# Altium schematic sheet A01_POWER_MCU.SchDoc: A01_POWER_MCU
size 420 x 296 mm; Revision: A-SCH-AD-R2-NO-TP; SheetNumber: 1; SheetTotal: 7
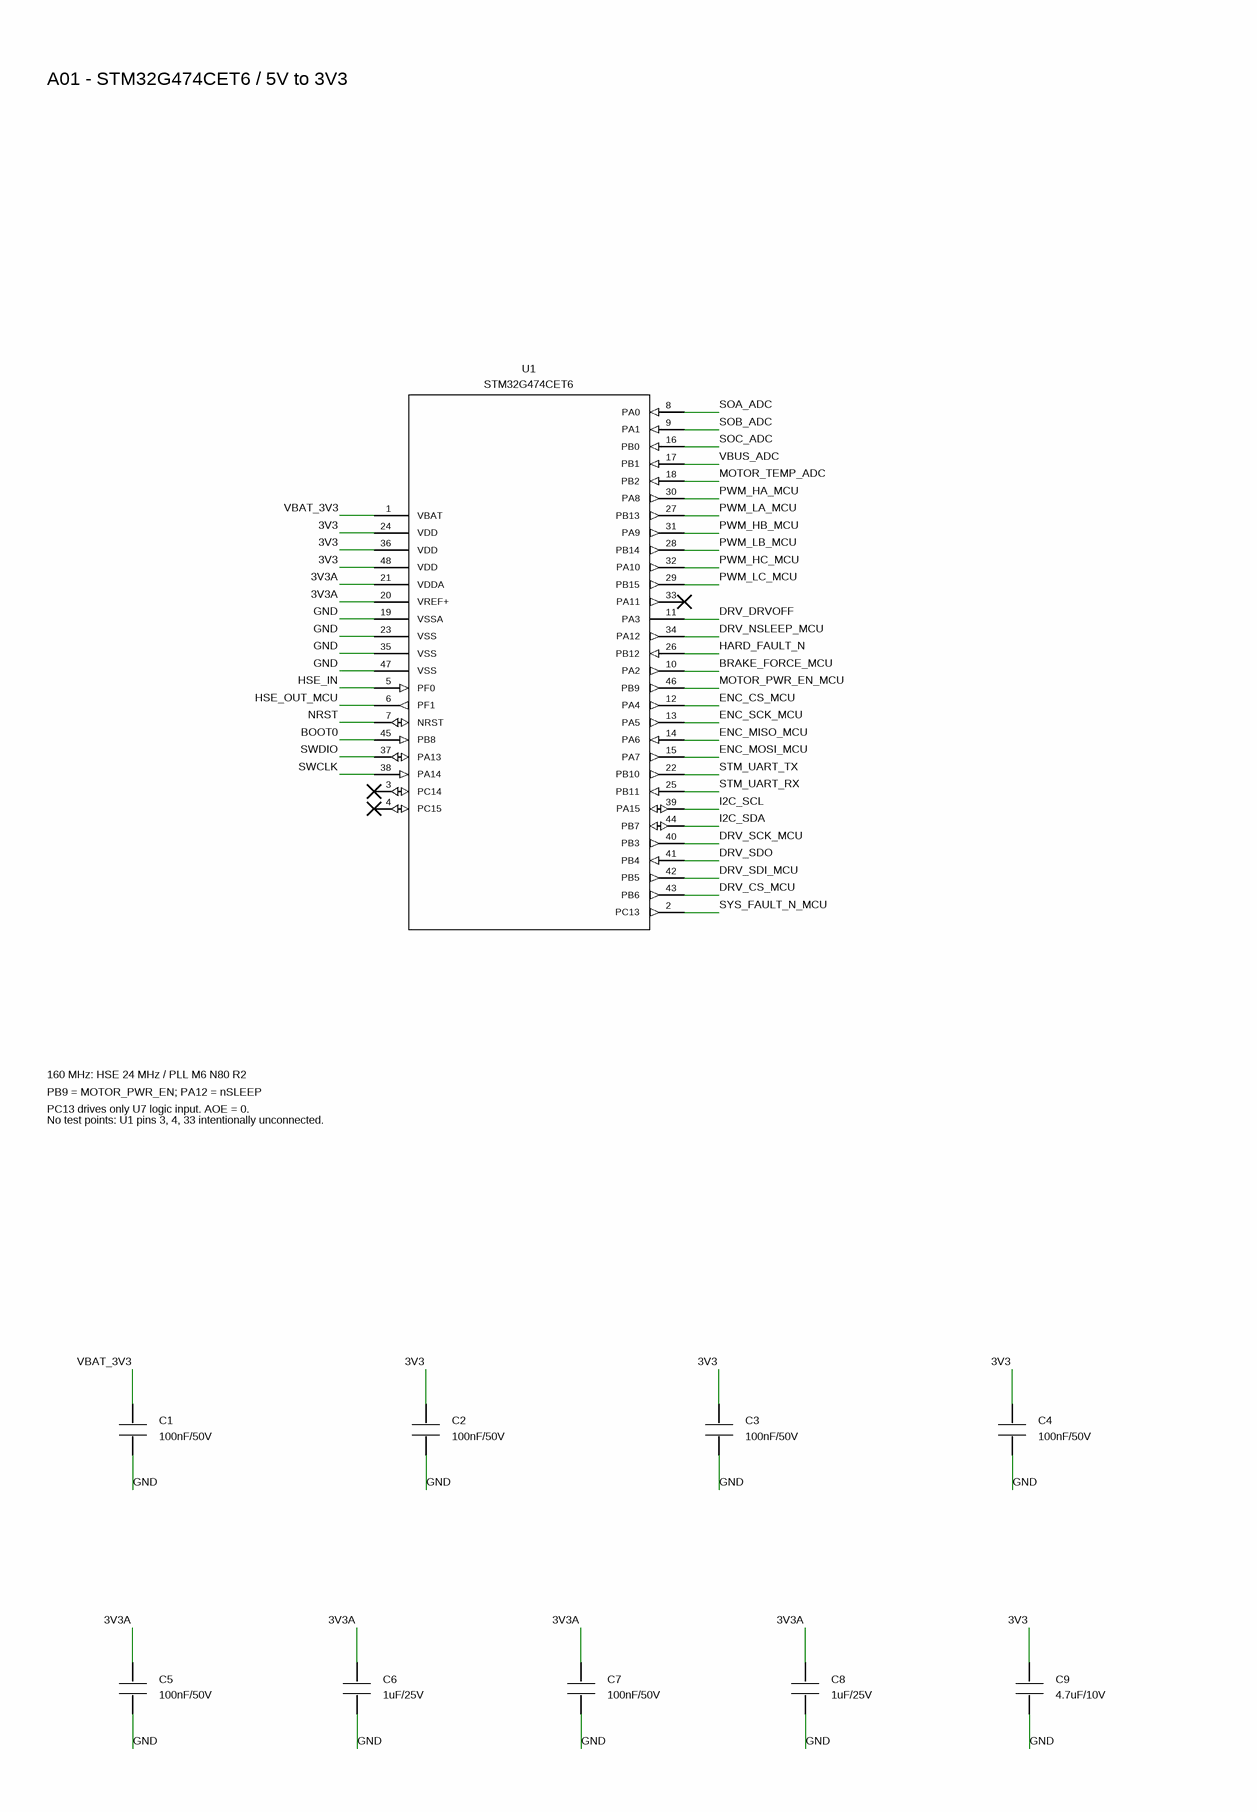
[diagram p0: A01_POWER_MCU.SchDoc, left]
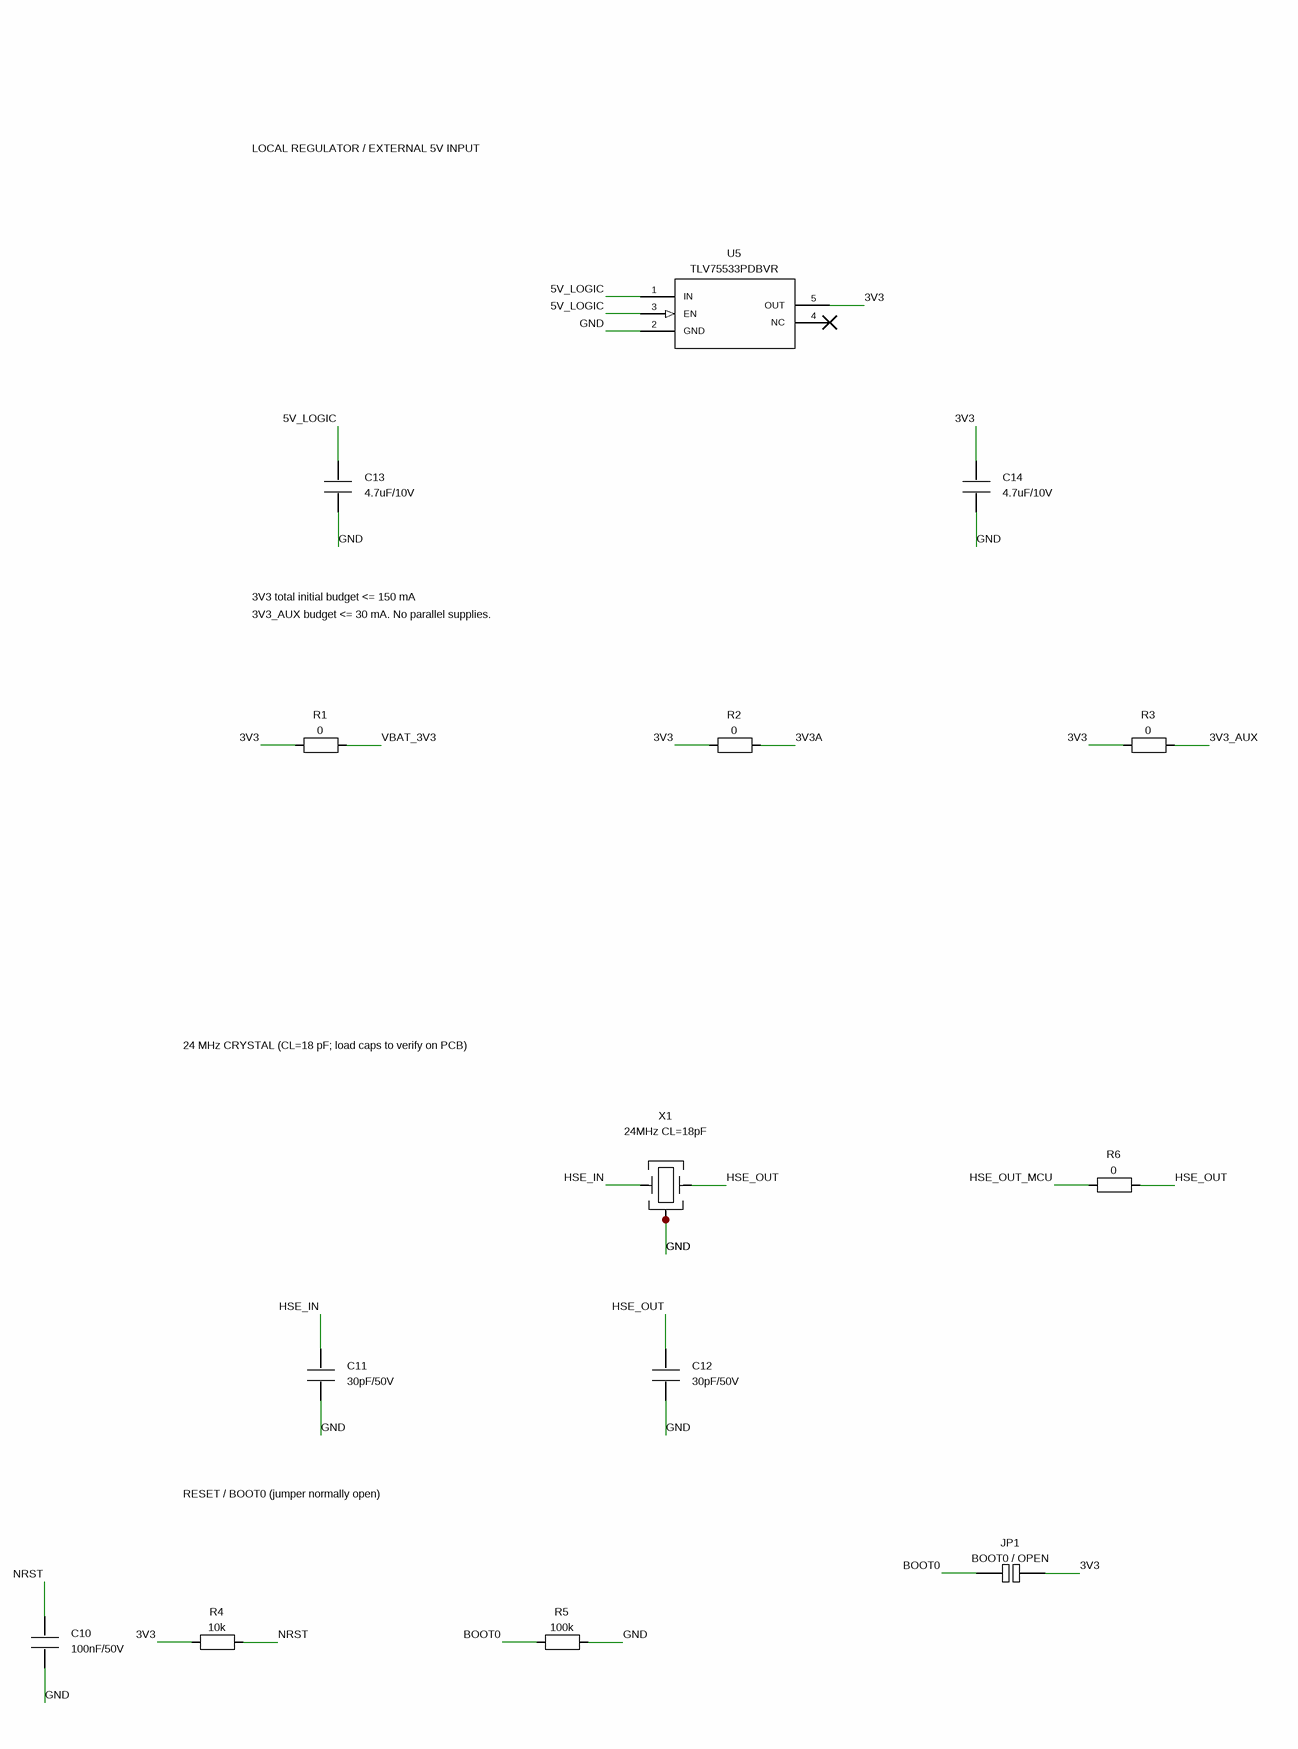
[diagram p1: A01_POWER_MCU.SchDoc, right]

## Parts
C1  100nF/50V  [C0603_M]
C2  100nF/50V  [C0603_M]
C3  100nF/50V  [C0603_M]
C4  100nF/50V  [C0603_M]
C5  100nF/50V  [C0603_M]
C6  1uF/25V  [C0603_M]
C7  100nF/50V  [C0603_M]
C8  1uF/25V  [C0603_M]
C9  4.7uF/10V  [C0805_M]
C10  100nF/50V  [C0603_M]
C11  30pF/50V  [C0603_M]
C12  30pF/50V  [C0603_M]
C13  4.7uF/10V  [C0805_M]
C14  4.7uF/10V  [C0805_M]
JP1  BOOT0 / OPEN
R1  0  [R0603_M]
R2  0  [R0805_M]
R3  0  [R0603_M]
R4  10k  [R0603_M]
R5  100k  [R0603_M]
R6  0  [R0603_M]
U1  STM32G474CET6  [QFP50P900X900X160-48N]
U5  TLV75533PDBVR  [SOT95P280X145-5N]
X1  24MHz CL=18pF  [XTAL-3225-4P]

## Nets
3V3: C2.1 C3.1 C4.1 C9.1 C14.1 JP1.2 R1.1 R2.1 R3.1 R4.1 U1.24(VDD) U1.36(VDD) U1.48(VDD) U5.5(OUT)
3V3_AUX: R3.2
3V3A: C5.1 C6.1 C7.1 C8.1 R2.2 U1.20(VREF+) U1.21(VDDA)
5V_LOGIC: C13.1 U5.1(IN) U5.3(EN)
BOOT0: JP1.1 R5.1 U1.45(PB8)
BRAKE_FORCE_MCU: U1.10(PA2)
DRV_CS_MCU: U1.43(PB6)
DRV_DRVOFF: U1.11(PA3)
DRV_NSLEEP_MCU: U1.34(PA12)
DRV_SCK_MCU: U1.40(PB3)
DRV_SDI_MCU: U1.42(PB5)
DRV_SDO: U1.41(PB4)
ENC_CS_MCU: U1.12(PA4)
ENC_MISO_MCU: U1.14(PA6)
ENC_MOSI_MCU: U1.15(PA7)
ENC_SCK_MCU: U1.13(PA5)
GND: C1.2 C2.2 C3.2 C4.2 C5.2 C6.2 C7.2 C8.2 C9.2 C10.2 C11.2 C12.2 C13.2 C14.2 R5.2 U1.19(VSSA) U1.23(VSS) U1.35(VSS) U1.47(VSS) U5.2(GND) X1.2(G) X1.4(G)
HARD_FAULT_N: U1.26(PB12)
HSE_IN: C11.1 U1.5(PF0) X1.1
HSE_OUT: C12.1 R6.2 X1.3
HSE_OUT_MCU: R6.1 U1.6(PF1)
I2C_SCL: U1.39(PA15)
I2C_SDA: U1.44(PB7)
MOTOR_PWR_EN_MCU: U1.46(PB9)
MOTOR_TEMP_ADC: U1.18(PB2)
NRST: C10.1 R4.2 U1.7(NRST)
PWM_HA_MCU: U1.30(PA8)
PWM_HB_MCU: U1.31(PA9)
PWM_HC_MCU: U1.32(PA10)
PWM_LA_MCU: U1.27(PB13)
PWM_LB_MCU: U1.28(PB14)
PWM_LC_MCU: U1.29(PB15)
SOA_ADC: U1.8(PA0)
SOB_ADC: U1.9(PA1)
SOC_ADC: U1.16(PB0)
STM_UART_RX: U1.25(PB11)
STM_UART_TX: U1.22(PB10)
SWCLK: U1.38(PA14)
SWDIO: U1.37(PA13)
SYS_FAULT_N_MCU: U1.2(PC13)
VBAT_3V3: C1.1 R1.2 U1.1(VBAT)
VBUS_ADC: U1.17(PB1)

Not connected (* = marked no-connect by the designer): U1 3(PC14)* 4(PC15)* 33(PA11)*; U5 4(NC)*

## Notes on the sheet
- A01 - STM32G474CET6 / 5V to 3V3
- LOCAL REGULATOR / EXTERNAL 5V INPUT
- 3V3 total initial budget <= 150 mA
- 3V3_AUX budget <= 30 mA. No parallel supplies.
- 160 MHz: HSE 24 MHz / PLL M6 N80 R2
- PB9 = MOTOR_PWR_EN; PA12 = nSLEEP
- PC13 drives only U7 logic input. AOE = 0.
- No test points: U1 pins 3, 4, 33 intentionally unconnected.
- 24 MHz CRYSTAL (CL=18 pF; load caps to verify on PCB)
- RESET / BOOT0 (jumper normally open)

## Library data of the parts
C1 C10 = C: 电容; MPN: CL10B104KB8NNNC; Source_KiCad_Footprint: GL30:C_0603_1608Metric; Specification: 100 nF / 50 V X7R; Assembly: FITTED; PCB_Model_Status: USER_LIBRARY_LINKED_PIN_NUMBERS_CHECKED; Package: 0603; Footprint_status: LIBRARY_SELECTED_PENDING_LAYOUT_REVIEW; Value: 100nF/50V
C2 = C: 电容; MPN: CL10B104KB8NNNC; Source_KiCad_Footprint: GL30:C_0603_1608Metric; Specification: 100 nF / 50 V X7R; Design_note: 对应U1 VDD脚24; Assembly: FITTED; PCB_Model_Status: USER_LIBRARY_LINKED_PIN_NUMBERS_CHECKED; Package: 0603; Footprint_status: LIBRARY_SELECTED_PENDING_LAYOUT_REVIEW; Value: 100nF/50V
C3 = C: 电容; MPN: CL10B104KB8NNNC; Source_KiCad_Footprint: GL30:C_0603_1608Metric; Specification: 100 nF / 50 V X7R; Design_note: 对应U1 VDD脚36; Assembly: FITTED; PCB_Model_Status: USER_LIBRARY_LINKED_PIN_NUMBERS_CHECKED; Package: 0603; Footprint_status: LIBRARY_SELECTED_PENDING_LAYOUT_REVIEW; Value: 100nF/50V
C4 = C: 电容; MPN: CL10B104KB8NNNC; Source_KiCad_Footprint: GL30:C_0603_1608Metric; Specification: 100 nF / 50 V X7R; Design_note: 对应U1 VDD脚48; Assembly: FITTED; PCB_Model_Status: USER_LIBRARY_LINKED_PIN_NUMBERS_CHECKED; Package: 0603; Footprint_status: LIBRARY_SELECTED_PENDING_LAYOUT_REVIEW; Value: 100nF/50V
C5 = C: 电容; MPN: CL10B104KB8NNNC; Source_KiCad_Footprint: GL30:C_0603_1608Metric; Specification: 100 nF / 50 V X7R; Design_note: U1.21 VDDA; Assembly: FITTED; PCB_Model_Status: USER_LIBRARY_LINKED_PIN_NUMBERS_CHECKED; Package: 0603; Footprint_status: LIBRARY_SELECTED_PENDING_LAYOUT_REVIEW; Value: 100nF/50V
C6 = C: 电容; MPN: CL10A105KA8NNNC; Source_KiCad_Footprint: GL30:C_0603_1608Metric; Specification: 1 µF / 25 V X5R; Design_note: U1.21 VDDA; Assembly: FITTED; PCB_Model_Status: USER_LIBRARY_LINKED_PIN_NUMBERS_CHECKED; Package: 0603; Footprint_status: LIBRARY_SELECTED_PENDING_LAYOUT_REVIEW; Value: 1uF/25V
C7 = C: 电容; MPN: CL10B104KB8NNNC; Source_KiCad_Footprint: GL30:C_0603_1608Metric; Specification: 100 nF / 50 V X7R; Design_note: U1.20 VREF+; Assembly: FITTED; PCB_Model_Status: USER_LIBRARY_LINKED_PIN_NUMBERS_CHECKED; Package: 0603; Footprint_status: LIBRARY_SELECTED_PENDING_LAYOUT_REVIEW; Value: 100nF/50V
C8 = C: 电容; MPN: CL10A105KA8NNNC; Source_KiCad_Footprint: GL30:C_0603_1608Metric; Specification: 1 µF / 25 V X5R; Design_note: U1.20 VREF+; Assembly: FITTED; PCB_Model_Status: USER_LIBRARY_LINKED_PIN_NUMBERS_CHECKED; Package: 0603; Footprint_status: LIBRARY_SELECTED_PENDING_LAYOUT_REVIEW; Value: 1uF/25V
C9 = C: 电容; MPN: 通用 0805 4.7 µF 10 V X7R; Source_KiCad_Footprint: GL30:C_0805_2012Metric; Specification: 4.7 µF / 10 V X7R; Design_note: MCU附近; Assembly: FITTED; PCB_Model_Status: USER_LIBRARY_LINKED_PIN_NUMBERS_CHECKED; Package: 0805; Footprint_status: LIBRARY_SELECTED_PENDING_LAYOUT_REVIEW; Value: 4.7uF/10V
C11 = C: 电容; MPN: 通用 0603 30 pF 50 V C0G; Source_KiCad_Footprint: GL30:C_0603_1608Metric; Specification: 30 pF / 50 V C0G ±5%; Design_note: X1 CL=18pF，按寄生3pF估算；起振后复核; Assembly: FITTED; PCB_Model_Status: USER_LIBRARY_LINKED_PIN_NUMBERS_CHECKED; Package: 0603; Footprint_status: LIBRARY_SELECTED_PENDING_LAYOUT_REVIEW; Value: 30pF/50V
C12 = C: 电容; MPN: 通用 0603 30 pF 50 V C0G; Source_KiCad_Footprint: GL30:C_0603_1608Metric; Specification: 30 pF / 50 V C0G ±5%; Design_note: 不可把晶体CL直接当作单颗负载电容值; Assembly: FITTED; PCB_Model_Status: USER_LIBRARY_LINKED_PIN_NUMBERS_CHECKED; Package: 0603; Footprint_status: LIBRARY_SELECTED_PENDING_LAYOUT_REVIEW; Value: 30pF/50V
C13 = C: 电容; MPN: 通用 0805 4.7 µF 10 V X7R; Source_KiCad_Footprint: GL30:C_0805_2012Metric; Specification: 4.7 µF / 10 V X7R; Design_note: U5输入，有效容量≥1µF; Assembly: FITTED; PCB_Model_Status: USER_LIBRARY_LINKED_PIN_NUMBERS_CHECKED; Package: 0805; Footprint_status: LIBRARY_SELECTED_PENDING_LAYOUT_REVIEW; Value: 4.7uF/10V
C14 = C: 电容; MPN: 通用 0805 4.7 µF 10 V X7R; Source_KiCad_Footprint: GL30:C_0805_2012Metric; Specification: 4.7 µF / 10 V X7R; Design_note: U5输出，有效容量≥1µF; Assembly: FITTED; PCB_Model_Status: USER_LIBRARY_LINKED_PIN_NUMBERS_CHECKED; Package: 0805; Footprint_status: LIBRARY_SELECTED_PENDING_LAYOUT_REVIEW; Value: 4.7uF/10V
JP1 = SolderJumper_2_Open: BOOT焊桥; MPN: PCB焊盘，无采购; Source_KiCad_Footprint: GL30:SolderJumper-2_P1.3mm_Open_RoundedPad1.0x1.5mm; Specification: 默认断开; Design_note: 只在烧录/救援时短接; Assembly: DNP_OR_DIRECT_WIRE_PADS; PCB_Model_Status: NOT_ASSIGNED_IN_ALTIUM_SCHEMATIC_DELIVERY; Package: 2焊盘焊桥; Footprint_status: LIBRARY_SELECTED_PENDING_LAYOUT_REVIEW; Value: BOOT0 / OPEN
R1 = R: 电阻; MPN: 通用0Ω跳线 0.1 W; Source_KiCad_Footprint: GL30:R_0603_1608Metric; Specification: 0 Ω跳线；0.1 W; Assembly: FITTED; PCB_Model_Status: USER_LIBRARY_LINKED_PIN_NUMBERS_CHECKED; Package: 0603; Footprint_status: LIBRARY_SELECTED_PENDING_LAYOUT_REVIEW; Value: 0
R2 = R: 电阻; MPN: 通用0Ω跳线 0.125 W; Source_KiCad_Footprint: GL30:R_0805_2012Metric; Specification: 0 Ω跳线；0.125 W; Design_note: 0805磁珠兼容焊盘；首装0Ω，不将模拟地割裂; Assembly: FITTED; PCB_Model_Status: USER_LIBRARY_LINKED_PIN_NUMBERS_CHECKED; Package: 0805; Footprint_status: LIBRARY_SELECTED_PENDING_LAYOUT_REVIEW; Value: 0
R3 = R: 电阻; MPN: 通用0Ω跳线 0.1 W; Source_KiCad_Footprint: GL30:R_0603_1608Metric; Specification: 0 Ω跳线；0.1 W; Design_note: 可拆以单独测B/C传感器电流; Assembly: FITTED; PCB_Model_Status: USER_LIBRARY_LINKED_PIN_NUMBERS_CHECKED; Package: 0603; Footprint_status: LIBRARY_SELECTED_PENDING_LAYOUT_REVIEW; Value: 0
R4 = R: 电阻; MPN: 通用厚膜 10k 1% 0.1 W; Source_KiCad_Footprint: GL30:R_0603_1608Metric; Specification: 10k Ω；1%；0.1 W; Assembly: FITTED; PCB_Model_Status: USER_LIBRARY_LINKED_PIN_NUMBERS_CHECKED; Package: 0603; Footprint_status: LIBRARY_SELECTED_PENDING_LAYOUT_REVIEW; Value: 10k
R5 = R: 电阻; MPN: 通用厚膜 100k 1% 0.1 W; Source_KiCad_Footprint: GL30:R_0603_1608Metric; Specification: 100k Ω；1%；0.1 W; Assembly: FITTED; PCB_Model_Status: USER_LIBRARY_LINKED_PIN_NUMBERS_CHECKED; Package: 0603; Footprint_status: LIBRARY_SELECTED_PENDING_LAYOUT_REVIEW; Value: 100k
R6 = R: 电阻; MPN: 通用0Ω跳线 0.1 W; Source_KiCad_Footprint: GL30:R_0603_1608Metric; Specification: 0 Ω跳线；0.1 W; Design_note: 晶体驱动调试位置，首装0Ω; Assembly: FITTED; PCB_Model_Status: USER_LIBRARY_LINKED_PIN_NUMBERS_CHECKED; Package: 0603; Footprint_status: LIBRARY_SELECTED_PENDING_LAYOUT_REVIEW; Value: 0
U1 = STM32G474CET6: FOC主控; Source_KiCad_Footprint: GL30:LQFP-48_7x7mm_P0.5mm; Design_note: 必须选CET6；不是NUCLEO上的RET6; Assembly: FITTED; PCB_Model_Status: USER_LIBRARY_LINKED_PIN_NUMBERS_CHECKED; Datasheet: https://www.st.com/resource/en/datasheet/stm32g474ce.pdf; MPN: STM32G474CET6; Package: LQFP48 7×7 mm，0.5 mm; Specification: STM32G474CET6; Footprint_status: LIBRARY_SELECTED_PENDING_LAYOUT_REVIEW; Value: STM32G474CET6
U5 = TLV75533PDBVR: 本地3.3 V稳压; Source_KiCad_Footprint: GL30:SOT-23-5; Design_note: 原B板B10不删除；本板3V3禁止与B/ESP的独立3V3并联; Assembly: FITTED; PCB_Model_Status: USER_LIBRARY_LINKED_PIN_NUMBERS_CHECKED; Datasheet: https://www.ti.com/lit/ds/symlink/tlv755p.pdf; MPN: TLV75533PDBVR; Package: DBV SOT-23-5; Specification: TLV75533PDBVR; Footprint_status: LIBRARY_SELECTED_PENDING_LAYOUT_REVIEW; Value: TLV75533PDBVR
X1 = Crystal_GND24: 无源晶体; MPN: ABM8-24.000MHZ-B2-T; Source_KiCad_Footprint: GL30:Crystal_SMD_3225-4Pin_3.2x2.5mm; Specification: 24 MHz；CL18 pF; Design_note: 1/3晶体，2/4外壳地；不可按倒角判1脚; Assembly: FITTED; PCB_Model_Status: USER_LIBRARY_LINKED_PIN_NUMBERS_CHECKED; Package: 3225 4焊盘; Footprint_status: LIBRARY_SELECTED_PENDING_LAYOUT_REVIEW; Value: 24MHz CL=18pF